# Altium project DARKYDEN.PrjPcb (part 4 of 4)

## Sheet BATTERY_GESTION.SchDoc: DARKYDEN_BATTERY_GESTION
size Letter; ApprovedBy: APPROUVÉ PAR; Author: Harold Malbrouck; Organization: Cegep Limoilou; Address1: 1300, 8e Avenue; Address2: Québec, QC; Address3: Canada; Address4: G1J 5L5; Revision: Rev.A; SheetNumber: 18; SheetTotal: 22
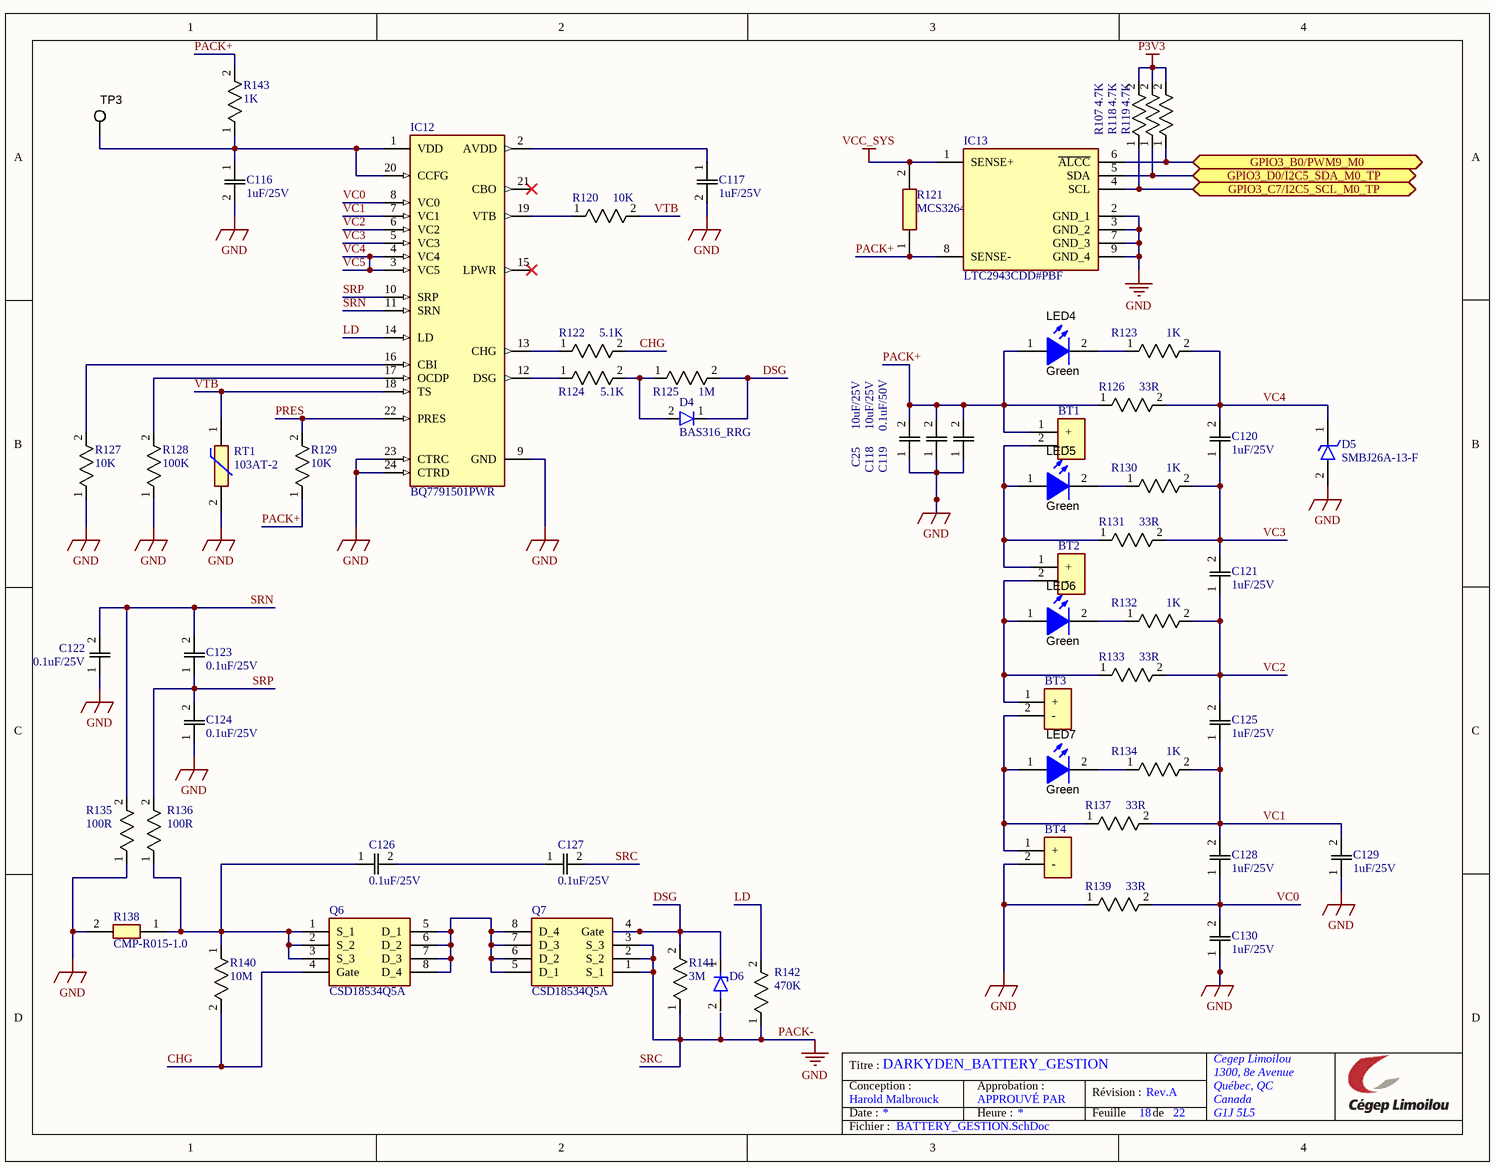
[diagram p7: BATTERY_GESTION.SchDoc]

### Parts
BT1  0530480210  [SHDRRA2W35P0X125_1X2_425X550X350P]  (value not drawn)
BT2  0530480210  [SHDRRA2W35P0X125_1X2_425X550X350P]  (value not drawn)
BT3  0530480210  [SHDRRA2W35P0X125_1X2_425X550X350P]  (value not drawn)
BT4  0530480210  [SHDRRA2W35P0X125_1X2_425X550X350P]  (value not drawn)
C25  10uF/25V  [CAP_CC0805_YAG]
C116  1uF/25V  [CAP_CC0805_YAG]
C117  1uF/25V  [CAP_CC0805_YAG]
C118  10uF/25V  [CAP_CC0805_YAG]
C119  0.1uF/50V  [CAP_CC0805_YAG]
C120  1uF/25V  [CAP_CC0805_YAG]
C121  1uF/25V  [CAP_CC0805_YAG]
C122  0.1uF/25V  [CAP_CC0805_YAG]
C123  0.1uF/25V  [CAP_CC0805_YAG]
C124  0.1uF/25V  [CAP_CC0805_YAG]
C125  1uF/25V  [CAP_CC0805_YAG]
C126  0.1uF/25V  [CAP_CC0805_YAG]
C127  0.1uF/25V  [CAP_CC0805_YAG]
C128  1uF/25V  [CAP_CC0805_YAG]
C129  1uF/25V  [CAP_CC0805_YAG]
C130  1uF/25V  [CAP_CC0805_YAG]
D4  BAS316_RRG  [BAS316RRG]
D5  SMBJ26A-13-F  [DIOM5336X250N]
D6  MMSZ5248B-7-F  [SOD3716X115N]  (value not drawn)
IC12  BQ7791501PWR  [SOP65P640X120-24N]
IC13  LTC2943CDD#PBF  [SON50P300X300X80-9N-D]
LED4  value Green  [LED_LTST-C190]  (hidden comment: LTST-C190GKT)
LED5  value Green  [LED_LTST-C190]  (hidden comment: LTST-C190GKT)
LED6  value Green  [LED_LTST-C190]  (hidden comment: LTST-C190GKT)
LED7  value Green  [LED_LTST-C190]  (hidden comment: LTST-C190GKT)
Q6  CSD18534Q5A  [Q5A]
Q7  CSD18534Q5A  [Q5A]
R107  4.7K  [RES_0816_SUS]
R118  4.7K  [RES_0816_SUS]
R119  4.7K  [RES_0816_SUS]
R120  10K  [RES_0816_SUS]
R121  MCS3264R010FER  [RESC6432X62N]
R122  5.1K  [RES_0816_SUS]
R123  1K  [RES_0816_SUS]
R124  5.1K  [RES_0816_SUS]
R125  1M  [RES_0816_SUS]
R126  33R  [RES_0816_SUS]
R127  10K  [RES_0816_SUS]
R128  100K  [RES_0816_SUS]
R129  10K  [RES_0816_SUS]
R130  1K  [RES_0816_SUS]
R131  33R  [RES_0816_SUS]
R132  1K  [RES_0816_SUS]
R133  33R  [RES_0816_SUS]
R134  1K  [RES_0816_SUS]
R135  100R  [RES_0816_SUS]
R136  100R  [RES_0816_SUS]
R137  33R  [RES_0816_SUS]
R138  CMP-R015-1.0  [RESC5025X70N]
R139  33R  [RES_0816_SUS]
R140  10M  [RES_0816_SUS]
R141  3M  [RES_0816_SUS]
R142  470K  [RES_0816_SUS]
R143  1K  [RES_0816_SUS]
RT1  103AT-2  [103AT2]
TP3  5016  [Testpoint_Keystone_Compact]  (value not drawn)

### Ports
GPIO3_B0/PWM9_M0 (bidir, see CONNECTEUR_4[3C]), GPIO3_C7/I2C5_SCL_M0_TP (bidir, see CONNECTEUR_4[2C]), GPIO3_D0/I2C5_SDA_M0_TP (bidir, see CONNECTEUR_4[2C])

### Nets
P3V3: R107.2 R118.2 R119.2
PACK-: BT4.2(-) C25.1 C116.2 C117.2 C118.1 C119.1 C122.1 C124.1 C127.2 C129.1 C130.1 D5.2(A) IC12.9(GND) IC12.23(CTRC) IC12.24(CTRD) IC13.2(GND_1) IC13.3(GND_2) IC13.7(GND_3) IC13.9(GND_4) Q7.1(S_1) Q7.2(S_2) Q7.3(S_3) R127.1 R128.1 R135.1 R138.2 R139.1 R141.1 R142.1 RT1.2  [also labelled GND, SRC]
VCC_SYS: IC13.1(SENSE+) R121.2
CHG: Q6.4(Gate) R122.2 R140.2
DSG: D4.1(K) D6.1(K) Q7.4(Gate) R125.2 R141.2
GPIO3_B0/PWM9_M0: IC13.6(~{ALCC}) R119.1 ; port GPIO3_B0/PWM9_M0
GPIO3_C7/I2C5_SCL_M0_TP: IC13.4(SCL) R107.1 ; port GPIO3_C7/I2C5_SCL_M0_TP
GPIO3_D0/I2C5_SDA_M0_TP: IC13.5(SDA) R118.1 ; port GPIO3_D0/I2C5_SDA_M0_TP
LD: IC12.14(LD) R142.2
PACK+: BT1.1(+) C25.2 C118.2 C119.2 IC13.8(SENSE-) LED4.1(A) R121.1 R126.1 R129.1 R143.2
PRES: IC12.22(PRES) R129.2
SRN: C122.2 C123.2 IC12.11(SRN) R135.2
SRP: C123.1 C124.2 IC12.10(SRP) R136.2
VC0: C128.1 C130.2 IC12.8(VC0) R139.2
VC1: C125.1 C128.2 C129.2 IC12.7(VC1) R134.2 R137.2
VC2: C121.1 C125.2 IC12.6(VC2) R132.2 R133.2
VC3: C120.1 C121.2 IC12.5(VC3) R130.2 R131.2
VC4: C120.2 D5.1(K) IC12.3(VC5) IC12.4(VC4) R123.2 R126.2  [also labelled VC5]
VTB: IC12.18(TS) R120.2 RT1.1
NetBT1_2: BT1.2(-) BT2.1(+) LED5.1(A) R131.1
NetBT2_2: BT2.2(-) BT3.1(+) LED6.1(A) R133.1
NetBT3_2: BT3.2(-) BT4.1(+) LED7.1(A) R137.1
NetC116_1: C116.1 IC12.1(VDD) IC12.20(CCFG) R143.1 TP3.1
NetC117_1: C117.1 IC12.2(AVDD)
NetC126_1: C126.1 Q6.1(S_1) Q6.2(S_2) Q6.3(S_3) R136.1 R138.1 R140.1
NetC126_2: C126.2 C127.1
NetD4_2: D4.2(A) R124.2 R125.1
NetIC12_12: IC12.12(DSG) R124.1
NetIC12_13: IC12.13(CHG) R122.1
NetIC12_16: IC12.16(CBI) R127.2
NetIC12_17: IC12.17(OCDP) R128.2
NetIC12_19: IC12.19(VTB) R120.1
NetLED4_2: LED4.2(K) R123.1
NetLED5_2: LED5.2(K) R130.1
NetLED6_2: LED6.2(K) R132.1
NetLED7_2: LED7.2(K) R134.1
NetQ6_5: Q6.5(D_1) Q6.6(D_2) Q6.7(D_3) Q6.8(D_4) Q7.5(D_1) Q7.6(D_2) Q7.7(D_3) Q7.8(D_4)

Not connected (* = marked no-connect by the designer): D6 2(A); IC12 15(LPWR)* 21(CBO)*

### Notes on the sheet
- Titre :
- Conception :
- Date :
- Approbation :
- Heure :
- Révision :
- Feuille
- de
- Fichier :

### Library data of the parts
BT1-BT4 = Header 1.25MM: Connector; Manufacturer_Name: Molex; Datasheet Link: https://www.molex.com/pdm_docs/sd/530480210_sd.pdf; Height: 3.5mm; Manufacturer_Part_Number: 0530480210; Mouser Part Number: N/A; Mouser Price/Stock: https://www.mouser.co.uk/ProductDetail/Molex/0530480210?qs=PBcRNPEHKsoxSi7zGV6Ncw%3D%3D; Arrow Part Number: 0530480210; Arrow Price/Stock: https://www.arrow.com/en/products/0530480210/molex?utm_currency=USD&region=europe
C25 C116-C130 = Capacitor_0805: No Description Available; Mfr_Name: Yageo
D4 = BAS316_RRG: Rectifier Diode Small Signal Switching 0.25A 4ns 2-Pin SOD-323 T/R; Manufacturer_Name: Taiwan Semiconductor; Manufacturer_Part_Number: BAS316 RRG; Max Reverse Voltage (DC): 100V; Average Rectified Current: 250mA; Datasheet Link: https://www.taiwansemi.com/assets/uploads/datasheet/BAS316_E1907.pdf; Height: 1.1mm; Mouser Part Number: 821-BAS316RRG; Mouser Price/Stock: https://www.mouser.co.uk/ProductDetail/Taiwan-Semiconductor/BAS316-RRG?qs=KwaGCOX4wIaA8PMRTc7F4Q%3D%3D; Arrow Part Number: BAS316 RRG; Arrow Price/Stock: https://www.arrow.com/en/products/bas316rrg/taiwan-semiconductor?region=europe; Supplier: Digikey; Supplier Part Number: BAS316RRGCT-ND; Manufacturer: Taiwan Semiconductor; Manufacturer Part Number: BAS316 RRG; RoHS: Yes; Category: Diodes; Stock: 41621; Pricing: 1=0.11, 10=0.081, 100=0.0564, 500=0.04008, 1000=0.03198 (USD); Mounting Technology: Surface Mount; Series: -; Packaging: Cut Tape; Reverse Recovery Time: 4ns; RoHS Compliant: Yes; ComponentLink1URL: https://www.taiwansemi.com/assets/uploads/datasheet/BAS316_E1907.pdf?src-supplier=Digikey; ComponentLink1Description: https://www.taiwansemi.com/assets/uploads/datasheet/BAS316_E1907.pdf?src-supplier=Digikey; ComponentLink2URL: https://datasheet.octopart.com/BAS316-RRG-Taiwan-Semiconductor-datasheet-166558704.pdf?src-supplier=Future+Electronics; ComponentLink2Description: https://datasheet.octopart.com/BAS316-RRG-Taiwan-Semiconductor-datasheet-166558704.pdf?src-supplier=Future+Electronics
D5 = SMBJ26A-13-F: TVS DIODE 26VWM 42.1VC SMB; Manufacturer_Name: Diodes Incorporated; Datasheet Link: https://www.diodes.com/assets/Datasheets/ds19002.pdf; Height: 2.5mm; Manufacturer_Part_Number: SMBJ26A-13-F; Mouser Part Number: 621-SMBJ26A-13-F; Mouser Price/Stock: https://www.mouser.co.uk/ProductDetail/Diodes-Incorporated/SMBJ26A-13-F?qs=gaDBXWSqsDCR7oWfjun1vA%3D%3D; Arrow Part Number: SMBJ26A-13-F; Arrow Price/Stock: https://www.arrow.com/en/products/smbj26a-13-f/diodes-incorporated?region=nac
D6 = MMSZ5248B-7-F: Zener Diode 18 V 500 mW ±5% Surface Mount SOD-123; Manufacturer_Name: Multicomp Pro; Datasheet Link: https://componentsearchengine.com/Datasheets/2/MMSZ5248B-7-F.pdf; Height: 1.15mm; Manufacturer_Part_Number: MMSZ5248B-7-F
IC12 = BQ7791501PWR: /Polymer 3~5 TSSOP-24 Battery Management ICs ROHS; Manufacturer_Name: Texas Instruments; Fault Protection: Over Current,Over Temperature,Short Circuit,Over/Under Voltage; Max Supply Voltage: 25V; Min Supply Voltage: 3V; Number of Cells: 5; Number of Outputs: 1; Output Voltage: 16V; Datasheet Link: https://www.ti.com/lit/gpn/BQ77915; Height: 1.2mm; Manufacturer_Part_Number: BQ7791501PWR; Mouser Part Number: 595-BQ7791501PWR; Mouser Price/Stock: https://www.mouser.co.uk/ProductDetail/Texas-Instruments/BQ7791501PWR?qs=B6kkDfuK7%2FBYqAWOM%2FFUaQ%3D%3D; Arrow Part Number: BQ7791501PWR; Arrow Price/Stock: null?region=nac; Supplier: Digikey; Supplier Part Number: 296-BQ7791501PWRCT-ND; Manufacturer: Texas Instruments; Manufacturer Part Number: BQ7791501PWR; RoHS: Yes; Category: Battery Management; Stock: 5538; Pricing: 1=1.62, 10=1.183, 25=1.0748, 100=0.9555, 250=0.89868, 500=0.86442, 1000=0.83623 (USD); Mounting Technology: Surface Mount; Case/Package: TSSOP; Pins: 24; Min Operating Temperature: -40°C; Max Operating Temperature: 85°C; Series: -; Length: 7.8mm; Width: 4.4mm; Thickness: 1mm; ComponentLink1URL: http://www.ti.com/general/docs/suppproductinfo.tsp?distId=10&amp;gotoUrl=http%3A%2F%2Fwww.ti.com%2Flit%2Fgpn%2Fbq77915&src-supplier=Digikey; ComponentLink1Description: http://www.ti.com/general/docs/suppproductinfo.tsp?distId=10&amp;gotoUrl=http%3A%2F%2Fwww.ti.com%2Flit%2Fgpn%2Fbq77915&src-supplier=Digikey
IC13 = LTC2943CDD#PBF: LTC2943 - Multicell Battery Gas Gauge with Temperature, Voltage and Current Measurement; Manufacturer_Name: Analog Devices; Manufacturer: Analog Devices / Linear Technology; Min Supply Voltage: 3.6V; Max Supply Voltage: 20V; Interface: I2C,SMBus; Battery Type: UNIVERSAL; Nominal Supply Current: 650uA; Datasheet Link: https://www.analog.com/media/en/technical-documentation/data-sheets/2943fa.pdf; Height: 0.8mm; Manufacturer_Part_Number: LTC2943CDD#PBF; Mouser Part Number: 584-LTC2943CDD#PBF; Mouser Price/Stock: https://www.mouser.co.uk/ProductDetail/Analog-Devices/LTC2943CDDPBF?qs=hVkxg5c3xu%2FXIG8gAJxzFw%3D%3D; Arrow Part Number: LTC2943CDD#PBF; Arrow Price/Stock: https://www.arrow.com/en/products/ltc2943cddpbf/analog-devices?utm_currency=USD&region=nac; Supplier: Digikey; Supplier Part Number: 505-LTC2943CDD#PBF-ND; Manufacturer Part Number: LTC2943CDD#PBF; RoHS: Yes; Category: Battery Management; Stock: 11003; Pricing: 1=7.04, 10=4.723, 25=4.1192, 121=3.55 (USD); Mounting Technology: Surface Mount; Case/Package: DFN; Pins: 8; Min Operating Temperature: 0°C; Max Operating Temperature: 70°C; Packaging: Rail/Tube; Series: -; Reach SVHC Compliant: No; RoHS Compliant: Yes; ComponentLink1URL: https://datasheet.ciiva.com/28383/1831515-28383394.pdf?src-supplier=Element14; ComponentLink1Description: https://datasheet.ciiva.com/28383/1831515-28383394.pdf?src-supplier=Element14; ComponentLink2URL: https://datasheet.ciiva.com/23944/1765916-23944624.pdf?src-supplier=Newark; ComponentLink2Description: https://datasheet.ciiva.com/23944/1765916-23944624.pdf?src-supplier=Newark; ComponentLink3URL: https://datasheet.ciiva.com/29610/44018-29610085.pdf?src-supplier=Digikey; ComponentLink3Description: https://datasheet.ciiva.com/29610/44018-29610085.pdf?src-supplier=Digikey; ComponentLink4URL: https://datasheet.ciiva.com/31395/1831515-31395594.pdf?src-supplier=Farnell; ComponentLink4Description: https://datasheet.ciiva.com/31395/1831515-31395594.pdf?src-supplier=Farnell
LED4-LED7 = LED_Gr_SMD: LED, Green, SMD; Manufacturer: Lite-On; Vf_V: 2.1V; Io_A: 20mA; Power_TotalModule: 100mW; Value1: 0.1W; CompType: LED; PartNumber: LTST-C190GKT; MountType: SMT; RoHS: Y; PackageReference: 1.6x0.8x0.8mm; Type: ?; Value2: 2.1V; Color: green; ComponentLink1URL: https://sps06.itg.ti.com/sites/KMS/crossdivteams/altium/docs/ComponentDatasheets/LTST-C190GKT.pdf; ComponentLink1Description: Datasheet link
Q6 Q7 = CSD18534Q5A: MOSFET N-Channel 60 V 13A (Ta), 50A (Tc) 3.1W (Ta), 77W (Tc) Surface Mount 8-VSONP (5x6); Manufacturer_Name: Texas Instruments; Datasheet Link: http://www.ti.com/lit/gpn/csd18534q5a; Manufacturer_Part_Number: CSD18534Q5A; Mouser Part Number: 595-CSD18534Q5A; Mouser Price/Stock: https://www.mouser.co.uk/ProductDetail/Texas-Instruments/CSD18534Q5A?qs=9Zb5cNRUa0ZPNHf4ZXtqIA%3D%3D; Arrow Part Number: CSD18534Q5A; Arrow Price/Stock: https://www.arrow.com/en/products/csd18534q5a/texas-instruments?utm_currency=USD&region=nac
R107 R118-R120 R122-R137 R139-R143 = RG1608P-104-B-T5: No Description Available; Mfr_Name: Susumu
R121 = MCS3264R010FER: Res Metal Alloy 2512 0.01 Ohm 1% 2W 50ppm/ C Molded SMD T/R; Manufacturer_Name: Ohmite; Value: 10mR; Voltage Rating: 220mV; Temperature Coefficient: 50ppm/°C; Datasheet Link: https://componentsearchengine.com/Datasheets/2/MCS3264R010FER.pdf; Height: 0.62mm; Manufacturer_Part_Number: MCS3264R010FER; Mouser Part Number: 588-MCS3264R010FER; Mouser Price/Stock: https://www.mouser.co.uk/ProductDetail/Ohmite/MCS3264R010FER?qs=SvApV4JM6f2MfSPuOPYXkg%3D%3D; Supplier: Digikey; Supplier Part Number: MCS3264R010FERCT-ND; Manufacturer: Ohmite; Manufacturer Part Number: MCS3264R010FER; RoHS: Yes; Category: Chip SMD Resistors; Stock: 27552; Pricing: 1=0.83, 10=0.538, 25=0.4588, 50=0.4092, 100=0.367, 250=0.32076, 500=0.29178, 1000=0.26717 (USD); Mounting Technology: Surface Mount; Case/Package: 2512; Pins: 2; Case Code (Metric): 3264; Case Code (Imperial): 1225; Min Operating Temperature: -25°C; Max Operating Temperature: 150°C; Package Quantity: 1; Power Rating: 2W; Tolerance: 1%; Packaging: Tape and Reel; Resistor Type: Metal Film,Metal Alloy; Number of Terminations: 2; Termination: SMD/SMT; Max Power Dissipation: 2W; Features: Flame Retardant Coating; Series: MCS; Resistance Tolerance: 1%; Technology: METAL ALLOY; Construction: Rectangular; Length: 6.4mm; Width: 3.2mm; Depth: 3.2mm; Military Standard: Not; RoHS Compliant: Yes; Reach SVHC Compliant: Unknown; ComponentLink1URL: https://datasheet.ciiva.com/2482/res-mcs-2482064.pdf?src-supplier=Digikey; ComponentLink1Description: https://datasheet.ciiva.com/2482/res-mcs-2482064.pdf?src-supplier=Digikey; ComponentLink2URL: https://datasheet.ciiva.com/2482/res-mcs-2482065.pdf?src-supplier=Digikey; ComponentLink2Description: https://datasheet.ciiva.com/2482/res-mcs-2482065.pdf?src-supplier=Digikey; ComponentLink3URL: https://datasheet.ciiva.com/2482/res-mcs-2482063.pdf?src-supplier=Digikey; ComponentLink3Description: https://datasheet.ciiva.com/2482/res-mcs-2482063.pdf?src-supplier=Digikey; ComponentLink4URL: https://datasheet.ciiva.com/46391/1807944-46391575.pdf?src-supplier=Element14; ComponentLink4Description: https://datasheet.ciiva.com/46391/1807944-46391575.pdf?src-supplier=Element14; ComponentLink5URL: https://datasheet.ciiva.com/7715/mcs-7715862.pdf?src-supplier=Element14; ComponentLink5Description: https://datasheet.ciiva.com/7715/mcs-7715862.pdf?src-supplier=Element14; ComponentLink6URL: https://datasheet.ciiva.com/5970/mcs-5970876.pdf?src-supplier=Farnell; ComponentLink6Description: https://datasheet.ciiva.com/5970/mcs-5970876.pdf?src-supplier=Farnell; ComponentLink7URL: https://datasheet.ciiva.com/5468/mcs-14321-5468876.pdf?src-supplier=Mouser; ComponentLink7Description: https://datasheet.ciiva.com/5468/mcs-14321-5468876.pdf?src-supplier=Mouser; ComponentLink8URL: https://datasheet.ciiva.com/28655/1842857-28655687.pdf?src-supplier=Element14; ComponentLink8Description: https://datasheet.ciiva.com/28655/1842857-28655687.pdf?src-supplier=Element14; ComponentLink9URL: https://datasheet.ciiva.com/16786/70024315-16786781.pdf?src-supplier=Allied+Electronics; ComponentLink9Description: https://datasheet.ciiva.com/16786/70024315-16786781.pdf?src-supplier=Allied+Electronics
R138 = Resistor 2010: Package 2010; Manufacturer_Name: Vishay; Manufacturer_Part_Number: CRCW20100000Z0EFHP; Datasheet Link: http://www.vishay.com/docs/20043/crcwhpe3.pdf; Height: 0.7mm; Mouser Part Number: 71-CRCW20100000Z0EFH; Mouser Price/Stock: https://www.mouser.co.uk/ProductDetail/Vishay-Dale/CRCW20100000Z0EFHP?qs=k2%2FDWSARqgGSaNuPGbWcpw%3D%3D; Arrow Part Number: CRCW20100000Z0EFHP; Arrow Price/Stock: https://www.arrow.com/en/products/crcw20100000z0efhp/vishay?region=nac
RT1 = 103AT-2: NTC Thermistor 10k Bead; Manufacturer_Name: Semitec; Datasheet Link: https://www.semitec-global.com/uploads/2022/01/P12-13-AT-Thermistor.pdf; Height: 9.5mm; Manufacturer_Part_Number: 103AT-2; Mouser Part Number: 954-103AT-2; Mouser Price/Stock: https://www.mouser.co.uk/ProductDetail/Semitec/103AT-2?qs=wgO0AD0o1vvcDzsKguD%252Bew%3D%3D
TP3 = TEST_POINT1: Test Point, Compact, SMT; Manufacturer: Keystone; CNHeader: FALSE; CT: TRUE; Green_Lifecycle: Active; Green_REACh: Passed; PartNumber: 5016; PackageReference: Testpoint_Keystone_Compact; CompType: Test Point; RoHS: Y; MountType: SMT; ComponentLink1Description: Datasheet URL; ComponentLink1URL: http://www.keyelco.com/userAssets/store/files/5016.PDF; Publisher: Texas Instruments; LatestRevisionDate: 26/05/2017; Supplier 1: Digi-Key; Supplier Part Number 1: 36-5016TR-ND; Supplier 2: Mouser; Supplier Part Number 2: 534-5016; Green_EU RoHS-2: Incomplete; Green_EU RoHS: Passed

## Nets that join several sheets
+3V3: HDMI (6 pins), NVME (R18.2 R22.2), eDP (C21.2 U13.1)
+5V: HDMI (8 pins), NVME (C26.2 U16.1)
P3V3: POWERSYSTEM (C87.2 U25.38), BATTERY_GESTION (R107.2 R118.2 R119.2)
PACK-: HDMI (27 pins), NVME (39 pins), SDCARD (11 pins), CONNECTEUR_2 (32 pins), eDP (18 pins), POWERSYSTEM (54 pins), BATTERY_GESTION (30 pins)